# Altium schematic sheet Fount.SchDoc
size A3
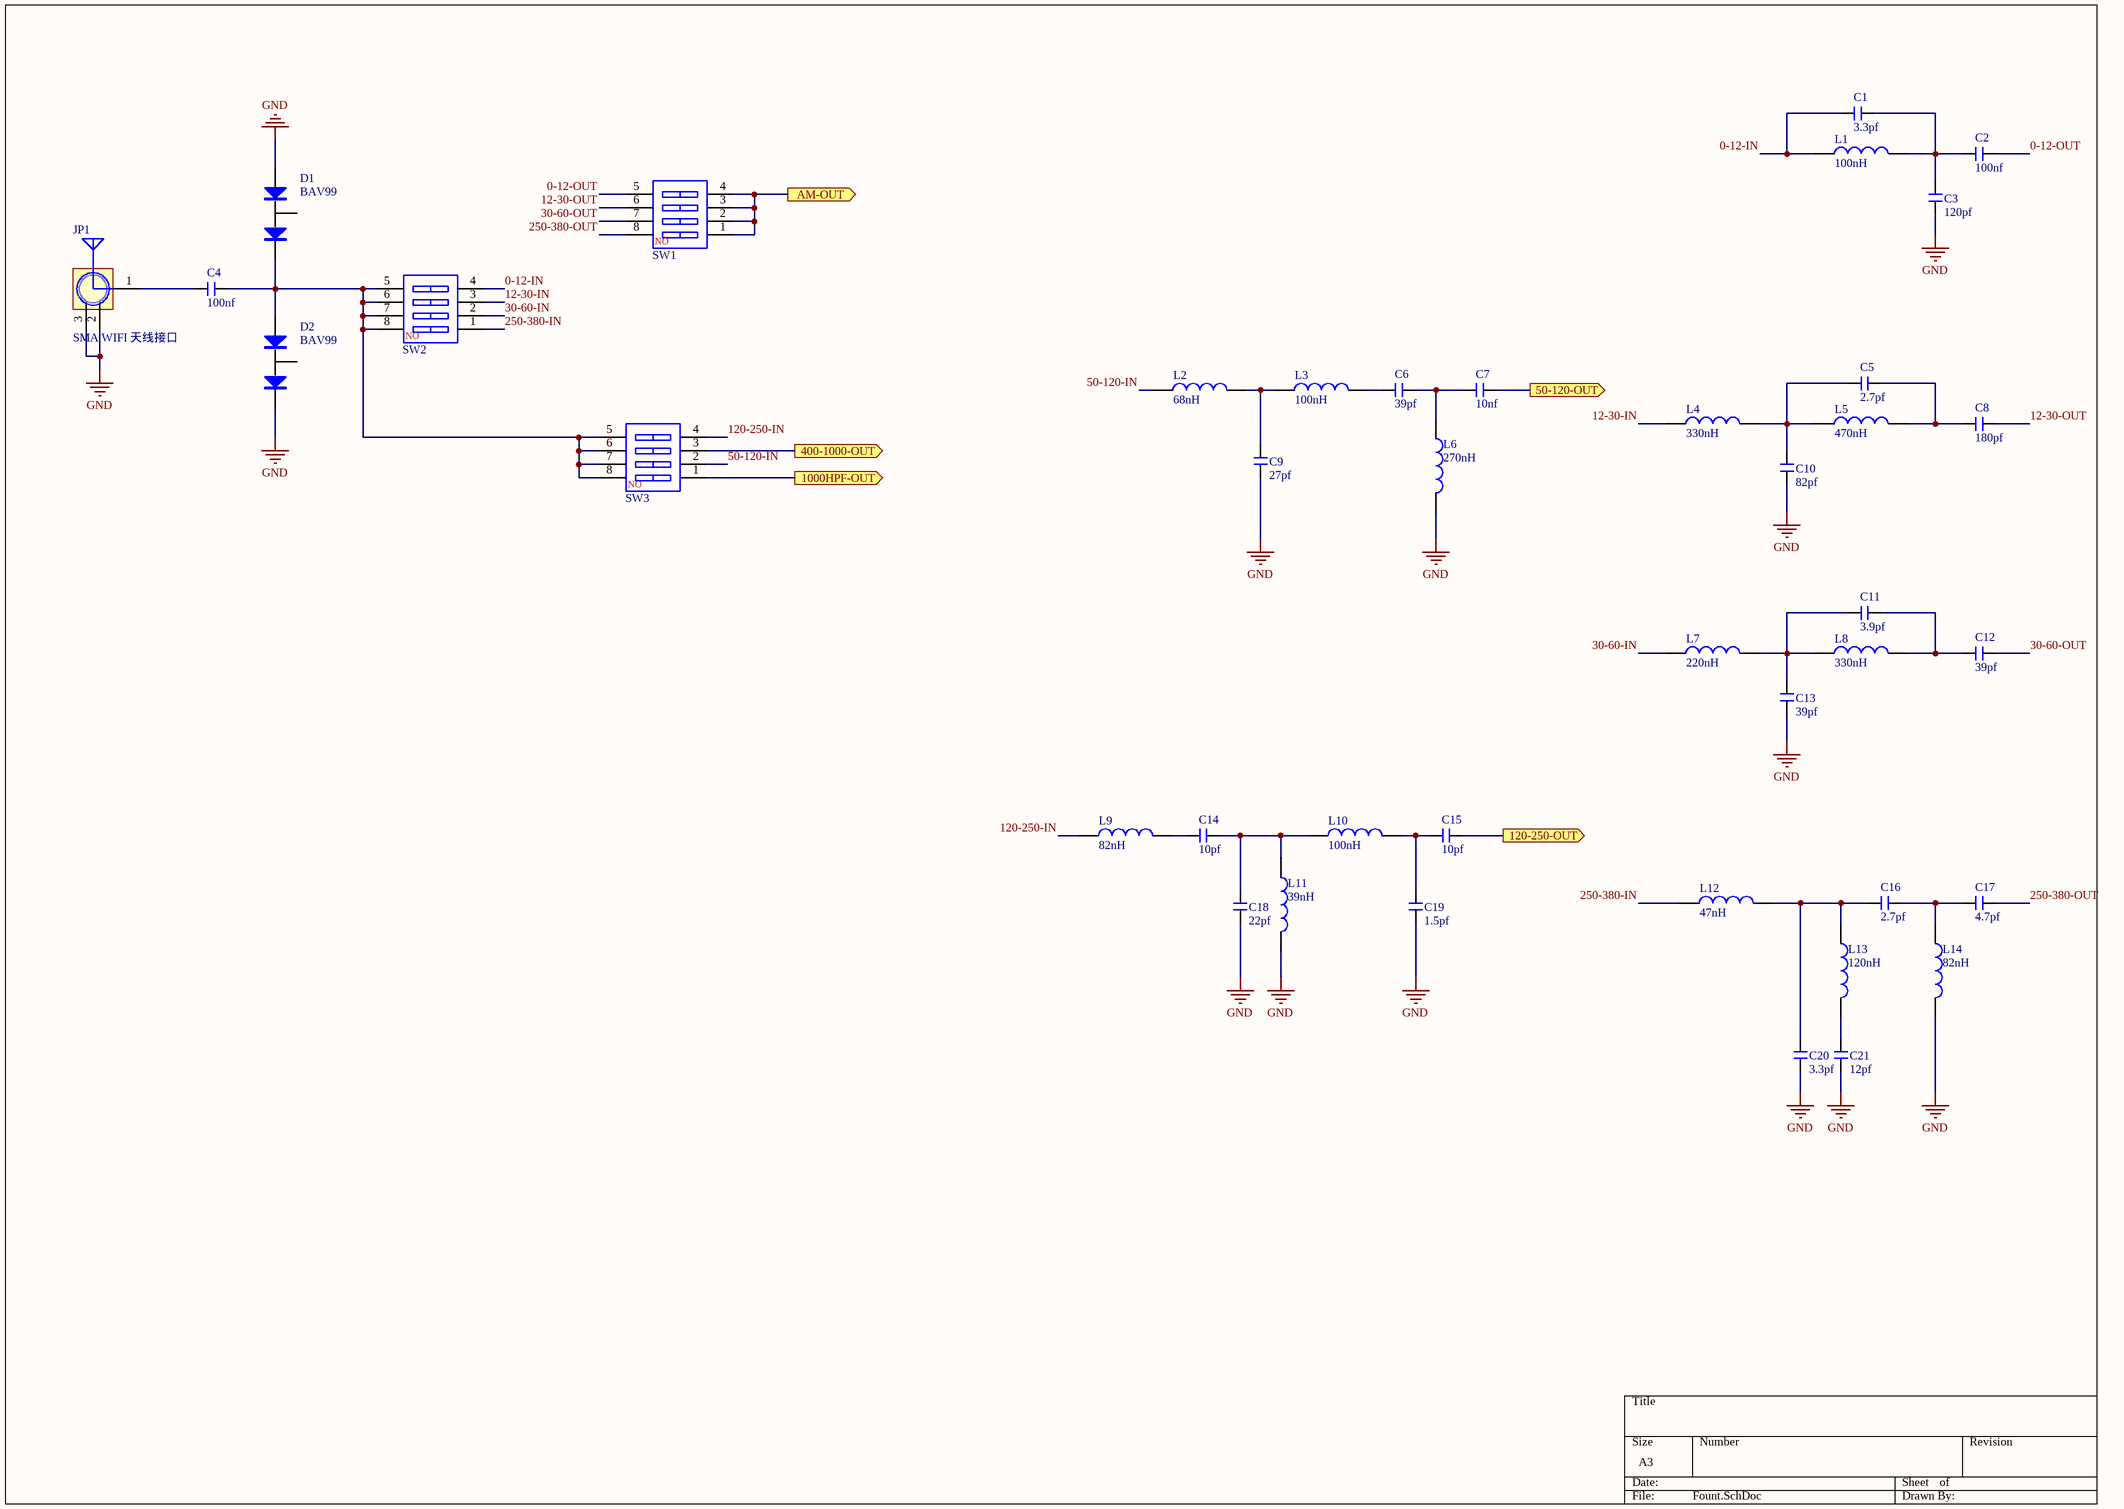
[diagram p0: Fount.SchDoc]

## Parts
C1  3.3pf  [C 0603_M]
C2  100nf  [C 0603_M]
C3  120pf  [C 0603_M]
C4  100nf  [C 0603_M]
C5  2.7pf  [C 0603_M]
C6  39pf  [C 0603_M]
C7  10nf  [C 0603_M]
C8  180pf  [C 0603_M]
C9  27pf  [C 0603_M]
C10  82pf  [C 0603_M]
C11  3.9pf  [C 0603_M]
C12  39pf  [C 0603_M]
C13  39pf  [C 0603_M]
C14  10pf  [C 0603_M]
C15  10pf  [C 0603_M]
C16  2.7pf  [C 0603_M]
C17  4.7pf  [C 0603_M]
C18  22pf  [C 0603_M]
C19  1.5pf  [C 0603_M]
C20  3.3pf  [C 0603_M]
C21  12pf  [C 0603_M]
D1  BAV99  [SOT23-3M]
D2  BAV99  [SOT23-3M]
JP1  SMA WIFI 天线接口  [SMA-KE]
L1  100nH  [L 0603]
L2  68nH  [L 0603]
L3  100nH  [L 0603]
L4  330nH  [L 0603]
L5  470nH  [L 0603]
L6  270nH  [L 0603]
L7  220nH  [L 0603]
L8  330nH  [L 0603]
L9  82nH  [L 0603]
L10  100nH  [L 0603]
L11  39nH  [L 0603]
L12  47nH  [L 0603]
L13  120nH  [L 0603]
L14  82nH  [L 0603]
SW1  CSW-4P  [CSW1.27 SMD-4P]  (value not drawn)
SW2  CSW-4P  [CSW1.27 SMD-4P]  (value not drawn)
SW3  CSW-4P  [CSW1.27 SMD-4P]  (value not drawn)

## Ports
50-120-OUT (out), 120-250-OUT (out), 400-1000-OUT (out), 1000HPF-OUT (out), AM-OUT (out)

## Nets
GND: C3.1 C9.1 C10.2 C13.2 C18.1 C19.1 C20.1 C21.1 D1.1 D2.2 JP1.2(GND) JP1.3(GND) L6.2 L11.2 L14.2
0-12-IN: C1.1 L1.1 SW2.4
0-12-OUT: C2.2 SW1.5
12-30-IN: L4.1 SW2.3
12-30-OUT: C8.2 SW1.6
30-60-IN: L7.1 SW2.2
30-60-OUT: C12.2 SW1.7
50-120-IN: L2.1 SW3.2
50-120-OUT: C7.2 ; port 50-120-OUT
120-250-IN: L9.1 SW3.4
120-250-OUT: C15.2 ; port 120-250-OUT
250-380-IN: L12.1 SW2.1
250-380-OUT: C17.2 SW1.8
400-1000-OUT: SW3.3 ; port 400-1000-OUT
1000HPF-OUT: SW3.1 ; port 1000HPF-OUT
AM-OUT: SW1.1 SW1.2 SW1.3 SW1.4 ; port AM-OUT
NetC1_2: C1.2 C2.1 C3.2 L1.2
NetC4_1: C4.1 JP1.1(ANT)
NetC4_2: C4.2 D1.2 D2.1 SW2.5 SW2.6 SW2.7 SW2.8 SW3.5 SW3.6 SW3.7 SW3.8
NetC5_1: C5.1 C10.1 L4.2 L5.1
NetC5_2: C5.2 C8.1 L5.2
NetC6_1: C6.1 L3.2
NetC6_2: C6.2 C7.1 L6.1
NetC9_2: C9.2 L2.2 L3.1
NetC11_1: C11.1 C13.1 L7.2 L8.1
NetC11_2: C11.2 C12.1 L8.2
NetC14_1: C14.1 L9.2
NetC14_2: C14.2 C18.2 L10.1 L11.1
NetC15_1: C15.1 C19.2 L10.2
NetC16_1: C16.1 C20.2 L12.2 L13.1
NetC16_2: C16.2 C17.1 L14.1
NetC21_2: C21.2 L13.2

Not connected (* = marked no-connect by the designer): D1 3; D2 3

## Notes on the sheet
- (in symbol CSW-4P) NO

## Library data of the parts
C1-C21 = C: 无极性贴片电容; 版权归属: 源创客; BOM名称: 无极性贴片电容; 学习资源: www.ooocke.com
D1 D2 = BAV99: 天线保护二极管
JP1 = SMA: SMA-2.4G射频天线接口; 版权归属: 源创客; BOM名称: SMA-2.4G射频天线接口; 学习资源: www.ooocke.com
L1-L14 = L: 小功率贴片电感; 版权归属: 源创客; BOM名称: 小功率贴片电感; 学习资源: www.ooocke.com
SW1-SW3 = CSW-4P: 4路编码开关; 版权归属: 源创客; BOM名称: 4路编码开关; 学习资源: www.ooocke.com